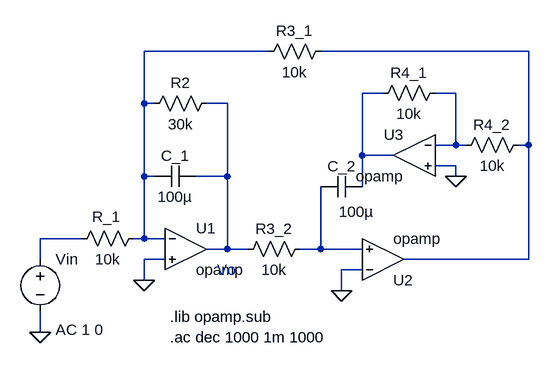
[diagram p0: schematic TS2_Albanesi_SimulacionPasabanda.asc]
TS2_Albanesi_SimulacionPasabanda.asc, the LTspice schematic file:
Version 4
SHEET 1 880 680
WIRE 176 -80 -16 -80
WIRE 576 -80 256 -80
WIRE 352 -16 320 -16
WIRE 464 -16 432 -16
WIRE -16 0 -16 -80
WIRE 0 0 -16 0
WIRE 112 0 80 0
WIRE 464 64 464 -16
WIRE 464 64 432 64
WIRE 480 64 464 64
WIRE 576 64 576 -80
WIRE 576 64 560 64
WIRE 320 80 320 -16
WIRE 368 80 320 80
WIRE 464 96 432 96
WIRE -16 112 -16 0
WIRE 0 112 -16 112
WIRE 112 112 112 0
WIRE 112 112 64 112
WIRE 464 112 464 96
WIRE 320 128 320 80
WIRE -112 208 -176 208
WIRE -16 208 -16 112
WIRE -16 208 -32 208
WIRE 16 208 -16 208
WIRE 112 224 112 112
WIRE 112 224 80 224
WIRE 144 224 112 224
WIRE 256 224 256 128
WIRE 256 224 224 224
WIRE 320 224 256 224
WIRE -176 240 -176 208
WIRE 16 240 -16 240
WIRE 576 240 576 64
WIRE 576 240 384 240
WIRE 320 256 288 256
WIRE -16 272 -16 240
WIRE 288 288 288 256
WIRE -176 352 -176 320
FLAG 464 112 0
FLAG 288 288 0
FLAG -16 272 0
FLAG -176 352 0
SYMBOL OpAmps\\opamp 48 160 R0
SYMATTR InstName U1
SYMBOL OpAmps\\opamp 352 304 M180
SYMATTR InstName U2
SYMBOL OpAmps\\opamp 400 16 M0
SYMATTR InstName U3
SYMBOL res 240 208 R90
WINDOW 0 0 56 VBottom 2
WINDOW 3 32 56 VTop 2
SYMATTR InstName R3_2
SYMATTR Value 10k
SYMBOL res -16 192 R90
WINDOW 0 -2 58 VBottom 2
WINDOW 3 32 56 VTop 2
SYMATTR InstName R_1
SYMATTR Value 10k
SYMBOL res 96 -16 R90
WINDOW 0 0 56 VBottom 2
WINDOW 3 32 56 VTop 2
SYMATTR InstName R2
SYMATTR Value 30k
SYMBOL cap 64 96 R90
WINDOW 0 0 32 VBottom 2
WINDOW 3 32 32 VTop 2
SYMATTR InstName C_1
SYMATTR Value 100µ
SYMBOL cap 320 112 R90
WINDOW 0 0 32 VBottom 2
WINDOW 3 39 9 VTop 2
SYMATTR InstName C_2
SYMATTR Value 100µ
SYMBOL res 448 -32 R90
WINDOW 0 0 56 VBottom 2
WINDOW 3 32 56 VTop 2
SYMATTR InstName R4_1
SYMATTR Value 10k
SYMBOL res 576 48 R90
WINDOW 0 0 56 VBottom 2
WINDOW 3 32 56 VTop 2
SYMATTR InstName R4_2
SYMATTR Value 10k
SYMBOL res 272 -96 R90
WINDOW 0 0 56 VBottom 2
WINDOW 3 32 56 VTop 2
SYMATTR InstName R3_1
SYMATTR Value 10k
SYMBOL voltage -176 224 R0
WINDOW 123 24 124 Left 2
WINDOW 39 0 0 Left 0
SYMATTR Value2 AC 1 0
SYMATTR InstName Vin
SYMATTR Value ""
TEXT 96 256 Left 2 ;Vo
TEXT 24 328 Left 2 !.lib opamp.sub
TEXT 24 360 Left 2 !.ac dec 1000 1m 1000

The netlist it stands for:
* TS2_Albanesi_SimulacionPasabanda.asc
XU1 N001 0 N005 opamp Aol=100K GBW=10Meg  ; pins invin noninvin out
XU2 0 N007 N002 opamp Aol=100K GBW=10Meg  ; pins invin noninvin out
XU3 N004 0 N003 opamp Aol=100K GBW=10Meg  ; pins invin noninvin out
R3_2 N007 N005 10k
R_1 N001 N006 10k
R2 N005 N001 30k
C_1 N005 N001 100µ
C_2 N003 N007 100µ
R4_1 N004 N003 10k
R4_2 N002 N004 10k
R3_1 N002 N001 10k
Vin N006 0 AC 1 0
* Vo
.lib opamp.sub
.ac dec 1000 1m 1000
.backanno
.end